# Altium schematic sheet pwr_IO.SchDoc
size A4
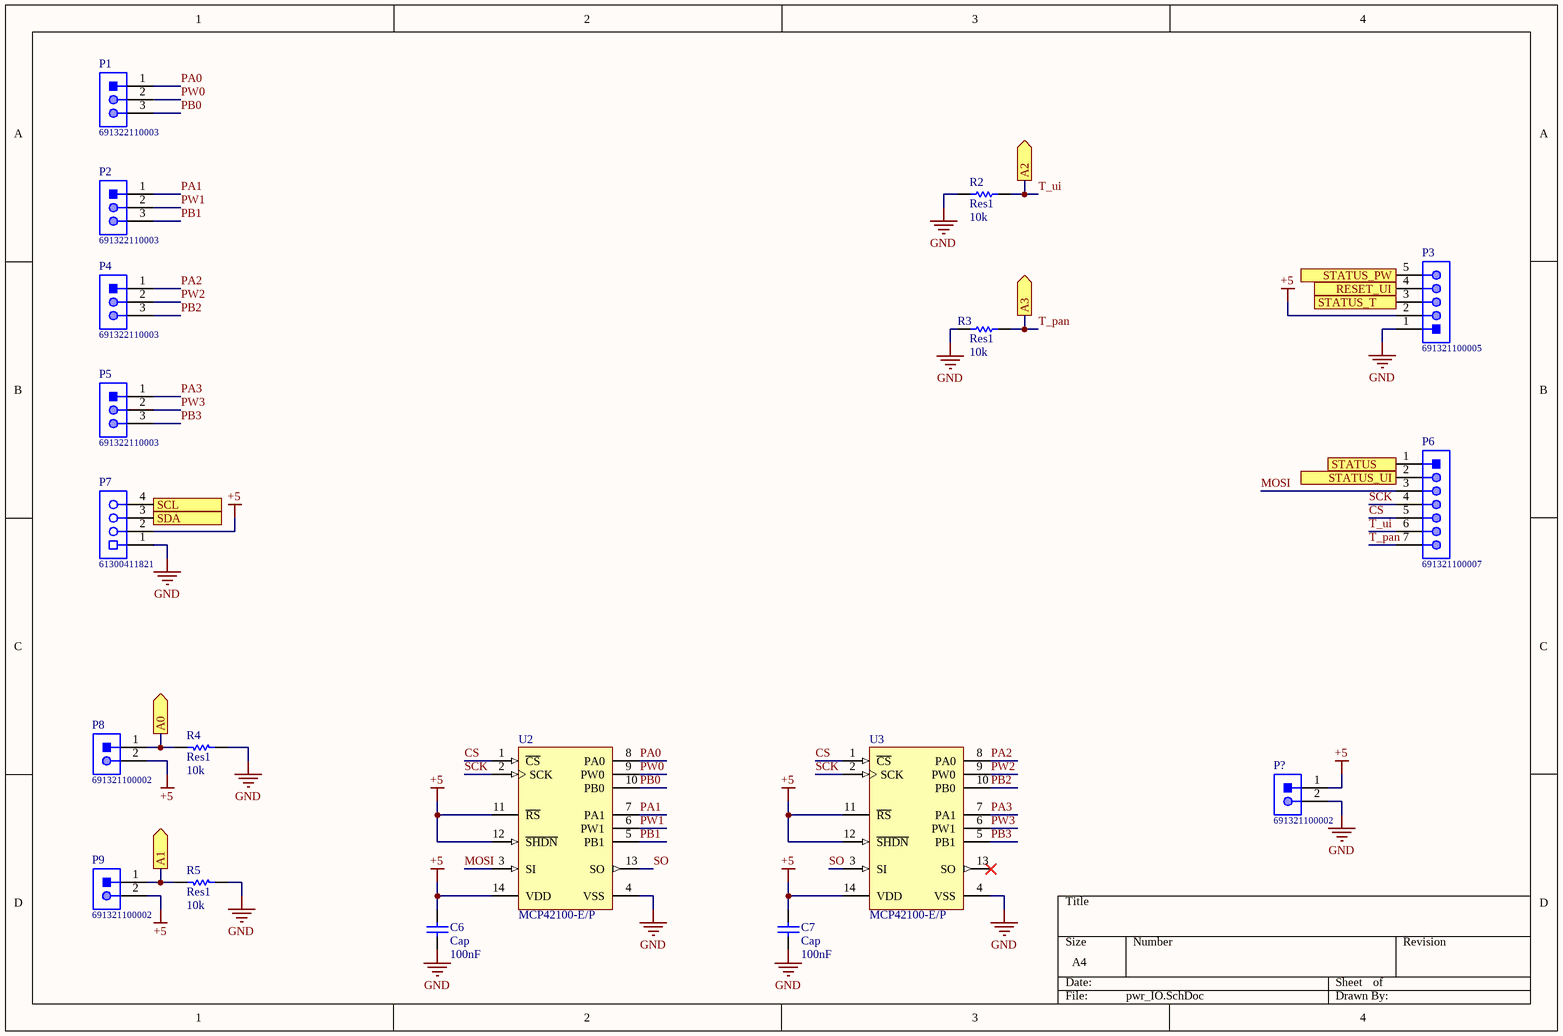
[diagram p0: pwr_IO.SchDoc]

## Parts
C6  Cap  value 100nF  [RAD-0.3]
C7  Cap  value 100nF  [RAD-0.3]
P1  691322110003  [691322110003]
P2  691322110003  [691322110003]
P3  691321100005  [691321100005]
P4  691322110003  [691322110003]
P5  691322110003  [691322110003]
P6  691321100007  [691321100007]
P7  61300411821  [61300411821]
P8  691321100002  [691321100002]
P9  691321100002  [691321100002]
P?  691321100002  [691321100002]
R2  Res1  value 10k  [AXIAL-0.3]
R3  Res1  value 10k  [AXIAL-0.3]
R4  Res1  value 10k  [AXIAL-0.3]
R5  Res1  value 10k  [AXIAL-0.3]
U2  MCP42100-E/P  [PDIP300-P14]
U3  MCP42100-E/P  [PDIP300-P14]

## Ports
A0 (out), A1 (out), A2 (out), A3 (out), RESET_UI (in), SCL (in), SDA (in), STATUS (out), STATUS_PW (in), STATUS_T (in), STATUS_UI (out)

## Nets
+5: C6.2 C7.2 P3.2 P7.2 P8.2 P9.2 P?.1 U2.11(~{RS}) U2.12(~{SHDN}) U2.14(VDD) U3.11(~{RS}) U3.12(~{SHDN}) U3.14(VDD)
GND: C6.1 C7.1 P3.1 P7.1 P?.2 R2.1 R3.1 R4.1 R5.1 U2.4(VSS) U3.4(VSS)
A0: P8.1 R4.2 ; port A0
A1: P9.1 R5.2 ; port A1
CS: P6.5 U2.1(~{CS}) U3.1(~{CS})
MOSI: P6.3 U2.3(SI)
PA0: P1.1 U2.8(PA0)
PA1: P2.1 U2.7(PA1)
PA2: P4.1 U3.8(PA0)
PA3: P5.1 U3.7(PA1)
PB0: P1.3 U2.10(PB0)
PB1: P2.3 U2.5(PB1)
PB2: P4.3 U3.10(PB0)
PB3: P5.3 U3.5(PB1)
PW0: P1.2 U2.9(PW0)
PW1: P2.2 U2.6(PW1)
PW2: P4.2 U3.9(PW0)
PW3: P5.2 U3.6(PW1)
RESET_UI: P3.4 ; port RESET_UI
SCK: P6.4 U2.2(SCK) U3.2(SCK)
SCL: P7.4 ; port SCL
SDA: P7.3 ; port SDA
SO: U2.13(SO) U3.3(SI)
STATUS: P6.1 ; port STATUS
STATUS_PW: P3.5 ; port STATUS_PW
STATUS_T: P3.3 ; port STATUS_T
STATUS_UI: P6.2 ; port STATUS_UI
T_pan: P6.7 R3.2 ; port A3
T_ui: P6.6 R2.2 ; port A2

Not connected (* = marked no-connect by the designer): U3 13(SO)*

## Library data of the parts
C6 C7 = Cap: Capacitor; Published: 8-Jun-2000; LatestRevisionDate: 17-Jul-2002; LatestRevisionNote: Re-released for DXP Platform.; PackageReference: RAD-0.3; Publisher: Altium Limited; PackageDescription: Radial Cap, Thru-Hole; 2 Leads; 0.3 in Pin Spacing
P1 P2 P4 P5 = CMP-1502-01792-1: Serie 3221 - 3.50mm Horizontal PCB Header WR-TBL, 3 pin; Manufacturer: Wurth Elektronik; Pin Number: 3; Gender: Male; Part Number: 691322110003; Pitch: 3.50mm; Manufacturer URL: http://www.we-online.de; Packaging: Box; Operating Temperature: -40to105degC; Datasheet URL: http://katalog.we-online.de/em/datasheet/6913221100xx.pdf; Publisher: WurthElektronik; Mounting Technology: THT; Package Reference: 691322110003
P3 = CMP-1502-01786-1: Serie 3211 - 3.50mm Vertical PCB Header WR-TBL, 5 pin; Manufacturer: Wurth Elektronik; Pin Number: 5; Gender: Male; Datasheet URL: http://katalog.we-online.de/em/datasheet/6913211000xx.pdf; Package Reference: 691321100005; Manufacturer URL: http://www.we-online.de; Pitch: 3.50mm; Operating Temperature: -40to105degC; Publisher: WurthElektronik; Packaging: Box; Part Number: 691321100005; Mounting Technology: THT
P6 = CMP-1502-01788-1: Serie 3211 - 3.50mm Vertical PCB Header WR-TBL, 7 pin; Manufacturer: Wurth Elektronik; Gender: Male; Pin Number: 7; Manufacturer URL: http://www.we-online.de; Package Reference: 691321100007; Part Number: 691321100007; Packaging: Box; Publisher: WurthElektronik; Operating Temperature: -40to105degC; Pitch: 3.50mm; Mounting Technology: THT; Datasheet URL: http://katalog.we-online.de/em/datasheet/6913211000xx.pdf
P7 = CMP-1502-01316-1: THT Vertical Socket Header WR-PHD, Pitch 2.54 mm, Single Row, 4 pins; Manufacturer: Wurth Elektronik; Working Voltage: 250VAC; Rated Current: 3A; Pin Number: 4; Withstanding Voltage: 500VAC; Contact Resistance: 20mOhm; Gender: Female; Pitch: 2.54mm; Datasheet URL: https://katalog.we-online.de/em/datasheet/6130xx11821.pdf; Part Number: 61300411821; Operating Temperature: -40to125degC; Row Number: Single; Package Reference: 61300411821; Orientation: Vertical; Publisher: WurthElektronik; Packaging: Tray; Manufacturer URL: http://www.we-online.de; Mounting Technology: THT
P8 P9 P? = CMP-1502-01783-1: Serie 3211 - 3.50mm Vertical PCB Header WR-TBL, 2 pin; Manufacturer: Wurth Elektronik; Gender: Male; Pin Number: 2; Part Number: 691321100002; Mounting Technology: THT; Manufacturer URL: http://www.we-online.de; Datasheet URL: http://katalog.we-online.de/em/datasheet/6913211000xx.pdf; Packaging: Box; Package Reference: 691321100002; Publisher: WurthElektronik; Pitch: 3.50mm; Operating Temperature: -40to105degC
R2-R5 = Res1: Resistor; Published: 8-Jun-2000; LatestRevisionDate: 17-Jul-2002; LatestRevisionNote: Re-released for DXP Platform.; PackageReference: AXIAL-0.3; Publisher: Altium Limited; PackageDescription: Axial Device, Thru-Hole; 2 Leads; 0.3 in Pin Spacing
U2 U3 = CMP-0188-00236-2: Single/Dual Digital Potentiometer with SPI Interface, 14-Pin PDIP, Extended Temperature; ComponentLink2Description: Datasheet; ComponentLink1URL: http://www.microchip.com/; ComponentLink3URL: http://www.microchip.com/stellent/groups/techpub_sg/documents/packagingspec/en012702.pdf; DatasheetVersion: Jul-2003; ComponentLink3Description: Package Specification; ComponentLink1Description: Manufacturer URL; PackageDescription: 14-Lead Plastic Dual In-Line (P) - 300 mil Body [PDIP]; PackageReference: PDIP300-P14; PackageVersion: revBB, Aug-2009; RevisionNote: URLs added.; ComponentLink2URL: http://ww1.microchip.com/downloads/en/DeviceDoc/11195c.pdf